# Altium project Proto_Lolek.PrjPcb
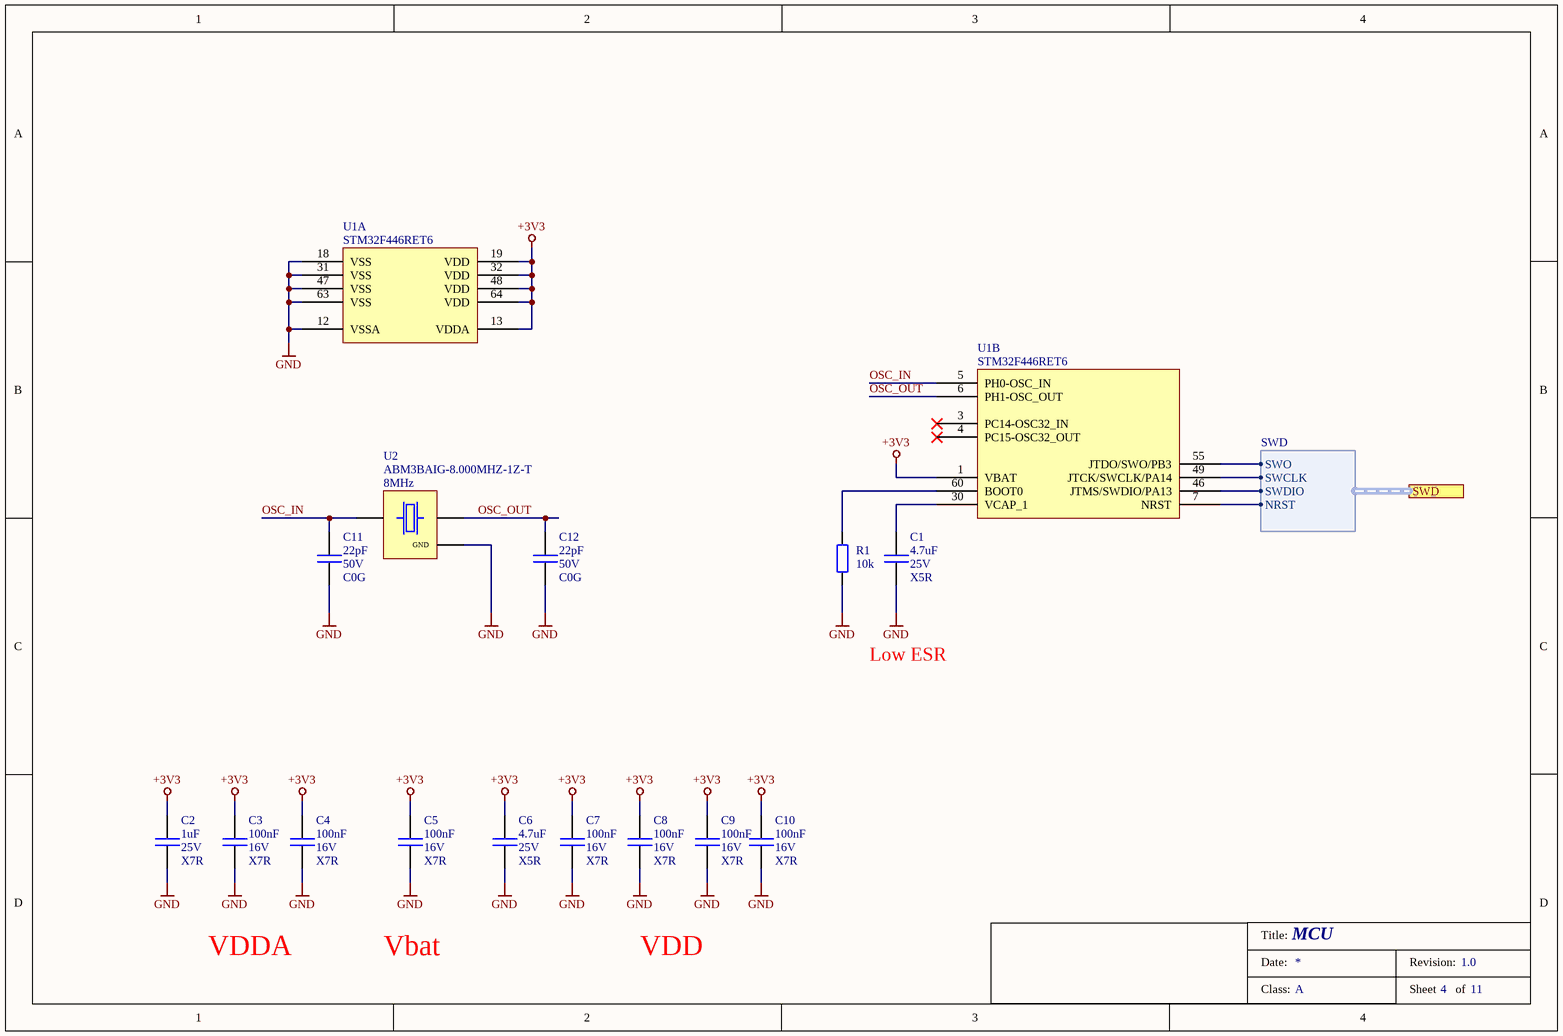
[diagram p0: MCU_Init.SchDoc]
7 sheets, 52 parts. Net scope: hierarchical (ports join the sheet entries above them; power ports are global).
Board file: Proto_Lolek.PcbDoc
Sheets:
  MCU_Init.SchDoc
  MCU_Supply.SchDoc
  Block_Diagram.SchDoc
    U_Current_Measurement = Current_Measurement.SchDoc
    U_Temp_NTC = Temp_NTC.SchDoc
    U_Connectors = Connectors.SchDoc
    U_Fan_Control = Fan_Control.SchDoc

## Sheet MCU_Init.SchDoc: MCU
size A4; Revision: 1.0; SheetNumber: 4; SheetTotal: 11; Class: A

### Parts
C1  value 4.7uF  Voltage: 25V  Dielectric: X5R  [C_0603]  (hidden comment: C)
C2  value 1uF  Voltage: 25V  Dielectric: X7R  [C_0603]  (hidden comment: C)
C3  value 100nF  Voltage: 16V  Dielectric: X7R  [C_0402]  (hidden comment: C)
C4  value 100nF  Voltage: 16V  Dielectric: X7R  [C_0402]  (hidden comment: C)
C5  value 100nF  Voltage: 16V  Dielectric: X7R  [C_0402]  (hidden comment: C)
C6  value 4.7uF  Voltage: 25V  Dielectric: X5R  [C_0603]  (hidden comment: C)
C7  value 100nF  Voltage: 16V  Dielectric: X7R  [C_0402]  (hidden comment: C)
C8  value 100nF  Voltage: 16V  Dielectric: X7R  [C_0402]  (hidden comment: C)
C9  value 100nF  Voltage: 16V  Dielectric: X7R  [C_0402]  (hidden comment: C)
C10  value 100nF  Voltage: 16V  Dielectric: X7R  [C_0402]  (hidden comment: C)
C11  value 22pF  Voltage: 50V  Dielectric: C0G  [C_0603]  (hidden comment: C)
C12  value 22pF  Voltage: 50V  Dielectric: C0G  [C_0603]  (hidden comment: C)
R1  value 10k  [R_0402]  (hidden comment: R)
U1  value STM32F446RET6  [LQFP64]  (hidden comment: MCU_STM32F446RET6)  (parts A,B of 3)
U2  value ABM3BAIG-8.000MHZ-1Z-T  Frequency: 8MHz  [CLK_ABM3BAIG_8_1Z_T]  (hidden comment: CLK_Crystal_4)

### Ports
SWD (harness SWD)

### Harnesses
SWD: SWO, SWCLK, SWDIO, NRST

### Nets
+3V3: C2.1 C3.1 C4.1 C5.1 C6.1 C7.1 C8.1 C9.1 C10.1 U1.1(VBAT) U1.13(VDDA) U1.19(VDD) U1.32(VDD) U1.48(VDD) U1.64(VDD)
GND: C1.2 C2.2 C3.2 C4.2 C5.2 C6.2 C7.2 C8.2 C9.2 C10.2 C11.2 C12.2 R1.1 U1.12(VSSA) U1.18(VSS) U1.31(VSS) U1.47(VSS) U1.63(VSS) U2.2(GND)
OSC_IN: C11.1 U1.5(PH0-OSC_IN) U2.1
OSC_OUT: C12.1 U1.6(PH1-OSC_OUT) U2.3
NetC1_1: C1.1 U1.30(VCAP_1)
NetR1_2: R1.2 U1.60(BOOT0)
NetU1_7: U1.7(NRST) ; port SWD.NRST
NetU1_46: U1.46(JTMS/SWDIO/PA13) ; port SWD.SWDIO
NetU1_49: U1.49(JTCK/SWCLK/PA14) ; port SWD.SWCLK
NetU1_55: U1.55(JTDO/SWO/PB3) ; port SWD.SWO

Not connected (* = marked no-connect by the designer): U1 3(PC14-OSC32_IN)* 4(PC15-OSC32_OUT)*

### Notes on the sheet
- Low ESR
- VDDA
- Vbat
- VDD
- Title:
- Date:
- Revision:
- Class:
- Sheet
- of

### Library data of the parts
C1 C6 = C_4.7uF_25V_0603: Capacitor; Manufacturer: TDK; Manufacturer Part Number: C1608X5R1E475K080AC; Tmax: 85; Tmin: -55; Grade: 3; Fail Rate: A; Tolerance: 10%; Part Number: C_4.7uF_25V_0603; HelpURL: https://product.tdk.com/system/files/dam/doc/product/capacitor/ceramic/mlcc/catalog/mlcc_commercial_general_en.pdf; Supplier 1: Mouser; Supplier Part Number 1: 810-C1608X5R1E475K; Status: Active
C2 = C_1uF_25V_0603: Capacitor; Manufacturer: Murata; Manufacturer Part Number: C0603T222K5RAC7867 / GCJ188R71E105KA01D; Tmax: 125; Tmin: -55; Grade: 2; Fail Rate: A; Tolerance: 10%; Part Number: C_1uF_25V_0603; HelpURL: https://www.murata.com/en-eu/api/pdfdownloadapi?cate=luCeramicCapacitorsSMD&partno=GCJ188R71E105KA01%23; Supplier 1: Mouser; Supplier Part Number 1: 81-GCJ188R71E105KA1D; Status: Active
C3-C5 C7-C10 = C_100nF_16V_0402: Capacitor; Manufacturer: Kemet; Manufacturer Part Number: C0402T104K4RAC7867; Tmax: 125; Tmin: -55; Grade: 2; Fail Rate: A; Tolerance: 10%; Part Number: C_100nF_16V_0402; HelpURL: https://api.kemet.com/component-edge/download/specsheet/C0402T104K4RACTU.pdf; Supplier 2: Mouser; Supplier Part Number 2: 80-C0402T104K4RACTU; Supplier 1: Digi-Key; Supplier Part Number 1: 399-17387-1-ND; Status: Active
C11 C12 = C_22pF_50V_0603: Capacitor; Manufacturer: Kemet; Manufacturer Part Number: C0603T220J5GAC7867; Tmax: 125; Tmin: -55; Grade: 2; Fail Rate: A; Tolerance: 5%; Part Number: C_22pF_50V_0603; HelpURL: https://content.kemet.com/datasheets/KEM_C1026_C0G_COTS_SMD.pdf; Supplier 1: Digi-Key; Supplier Part Number 1: 399-20427-1-ND; Status: Active
R1 = R_10k_50V_0402: Manufacturer: Vishay; Manufacturer Part Number: MCS0402PD1002DE500; Voltage: 50V; RMS Power: 0.2W; TCR: 25ppm; Tmax: 175; Tmin: -55; Grade: 2; Part Number: R_10k_50V_0402; HelpURL: https://www.vishay.com/docs/28916/mcxhp.pdf; Supplier 2: Mouser; Supplier Part Number 2: 594-MCS0402PD1002DP5; Supplier 1: Digi-Key; Supplier Part Number 1: 749-1515-1-ND; Status: Active
U1 = STM32F446RET6: ARM Microcontroller, Cortex-M4 core; Manufacturer: St; Tmax: 85; Tmin: -40; Grade: 3; Part Number: STM32F446RET6; HelpURL: https://www.st.com/content/ccc/resource/technical/document/datasheet/65/cb/75/50/53/d6/48/24/DM00141306.pdf/files/DM00141306.pdf/jcr:content/translations/en.DM00141306.pdf; Manufacturer Part Number: STM32F446RET6; Supplier 1: Mouser; Supplier Part Number 1: 511-STM32F446RET6; Status: Active
U2 = ABM3BAIG-8.000MHZ-1Z-T: Crystal; Manufacturer: ABRACON; Frequency Stability: ±50 ppm; Tmax: 125; Tmin: -40; Grade: 2; Part Number: ABM3BAIG-8.000MHZ-1Z-T; HelpURL: https://abracon.com/AIGcrystals/ABM3BAIG.pdf; Manufacturer Part Number: ABM3BAIG-8.000MHZ-1Z-T; Supplier 1: Mouser; Supplier Part Number 1: 815-M3BAIG-8-1ZT; Status: Active

## Sheet MCU_Supply.SchDoc: MCU Supply
size A4; Revision: 1.0; SheetNumber: 6; SheetTotal: 11; Class: B
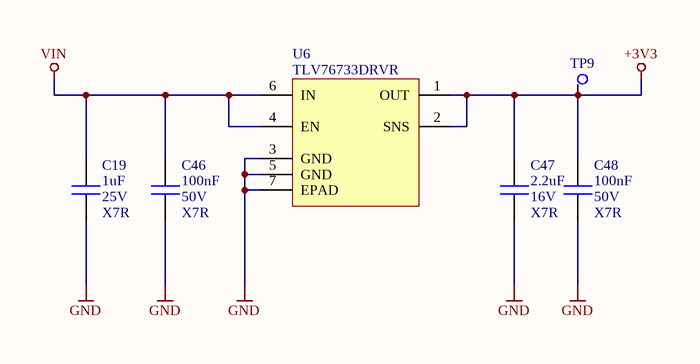
[diagram p1: MCU_Supply.SchDoc]

### Parts
C19  value 1uF  Voltage: 25V  Dielectric: X7R  [C_0603]  (hidden comment: C)
C46  value 100nF  Voltage: 50V  Dielectric: X7R  [C_0603]  (hidden comment: C)
C47  value 2.2uF  Voltage: 16V  Dielectric: X7R  [C_0805]  (hidden comment: C)
C48  value 100nF  Voltage: 50V  Dielectric: X7R  [C_0603]  (hidden comment: C)
TP9  TP_TestPoint  [TP_01]  (value not drawn)
U6  =Value: TLV76733DRVR  [WSON_6]  (hidden comment: IC_TLV76733DRVR)

### Nets
+3V3: C47.1 C48.1 TP9.1 U6.1(OUT) U6.2(SNS)
GND: C19.2 C46.2 C47.2 C48.2 U6.3(GND) U6.5(GND) U6.7(EPAD)
VIN: C19.1 C46.1 U6.4(EN) U6.6(IN)

### Notes on the sheet
- Title:
- Date:
- Revision:
- Class:
- Sheet
- of

### Library data of the parts
C19 = C_1uF_25V_0603: as C2 on sheet MCU_Init; Part Number: C_1uF_25V_0603; HelpURL: https://www.murata.com/en-eu/api/pdfdownloadapi?cate=luCeramicCapacitorsSMD&partno=GCJ188R71E105KA01%23; Supplier 1: Mouser; Supplier Part Number 1: 81-GCJ188R71E105KA1D; Status: Active
C46 C48 = C_100nF_50V_0603: Capacitor; Manufacturer: Kemet; Manufacturer Part Number: C0603T104K5RCL7136; Tmax: 125; Tmin: -55; Grade: 2; Fail Rate: A; Tolerance: 10%; Part Number: C_100nF_50V_0603; HelpURL: https://content.kemet.com/datasheets/KEM_C1027_X7R_COTS_SMD.pdf; Supplier 1: Digi-Key; Supplier Part Number 1: 399-6305-1-ND; Status: Active
C47 = C_2.2uF_16V_0805: Capacitor; Manufacturer: Kemet; Manufacturer Part Number: C0805T225K4RAL7800; Tmax: 125; Tmin: -55; Grade: 2; Fail Rate: A; Tolerance: 10%; Part Number: C_2.2uF_16V_0805; HelpURL: https://content.kemet.com/datasheets/KEM_C1027_X7R_COTS_SMD.pdf; Supplier 1: Digi-Key; Supplier Part Number 1: 399-17975-6-ND; Status: Active
TP9 = TestPoint1: Manufacturer: Progresja Space; Value: TP; Grade: 3; Part Number: TestPoint1; Status: Active
U6 = TLV76733DRVR: 3.3V LDO Voltage Regulator; Manufacturer: TI; Tmax: 125; Tmin: -40; Grade: 2; Part Number: TLV76733DRVR; Value: TLV76733DRVR; HelpURL: https://www.ti.com/lit/ds/symlink/tlv767.pdf?ts=1677533353578&ref_url=https%253A%252F%252Fwww.ti.com%252Fproduct%252FTLV767%252Fpart-details%252FTLV76733DRVR; Manufacturer Part Number: TLV76733DRVR; Supplier 2: Mouser; Supplier Part Number 2: 595-TLV76733DRVR; Status: Active

## Sheet Block_Diagram.SchDoc: Block Diagram
size A4; Revision: 1.0; SheetNumber: 1; SheetTotal: 11; Class: B
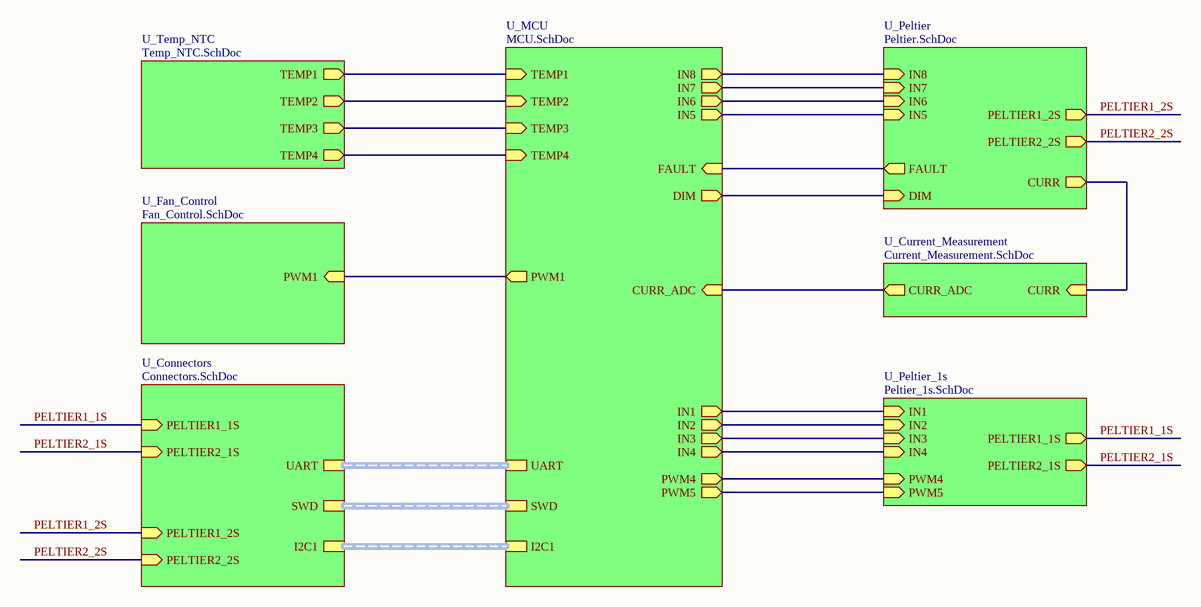
[diagram p2: Block_Diagram.SchDoc]

### Sub-sheets
U_Connectors = Connectors.SchDoc: SWD (harness SWD), UART (harness UART), PELTIER1_2S (in), PELTIER2_1S (in), PELTIER1_1S (in), PELTIER2_2S (in), I2C1 (harness I2C1)
U_Current_Measurement = Current_Measurement.SchDoc: CURR_ADC (out), CURR (in)
U_Fan_Control = Fan_Control.SchDoc: PWM1 (in)
U_MCU = MCU.SchDoc (file not in this document): FAULT (in), CURR_ADC (in), SWD (harness SWD), TEMP1 (in), TEMP2 (in), TEMP3 (in), TEMP4 (in), DIM (out), UART (harness UART), PWM1 (out), PWM4 (out), IN2 (out), IN4 (out), IN3 (out), PWM5 (out), IN1 (out), IN6 (out), IN5 (out), IN8 (out), IN7 (out), I2C1
U_Peltier = Peltier.SchDoc (file not in this document): DIM (in), FAULT (out), PELTIER1_2S (out), PELTIER2_2S (out), IN6 (in), IN5 (in), CURR (out), IN8 (in), IN7 (in)
U_Peltier_1s = Peltier_1s.SchDoc (file not in this document): PELTIER1_1S (out), PELTIER2_1S (out), PWM4 (in), PWM5 (in), IN1 (in), IN2 (in), IN3 (in), IN4 (in)
U_Temp_NTC = Temp_NTC.SchDoc: TEMP1 (out), TEMP3 (out), TEMP4 (out), TEMP2 (out)

### Nets
PELTIER1_1S: sheet U_Connectors/PELTIER1_1S, sheet U_Peltier_1s/PELTIER1_1S
PELTIER1_2S: sheet U_Peltier/PELTIER1_2S, sheet U_Connectors/PELTIER1_2S
PELTIER2_1S: sheet U_Connectors/PELTIER2_1S, sheet U_Peltier_1s/PELTIER2_1S
PELTIER2_2S: sheet U_Peltier/PELTIER2_2S, sheet U_Connectors/PELTIER2_2S
NetR2_2: sheet U_Temp_NTC/TEMP1, sheet U_MCU/TEMP1
NetR3_2: sheet U_Temp_NTC/TEMP2, sheet U_MCU/TEMP2
NetR6_2: sheet U_Temp_NTC/TEMP3, sheet U_MCU/TEMP3
NetR7_2: sheet U_Temp_NTC/TEMP4, sheet U_MCU/TEMP4
NetR19_1: sheet U_Current_Measurement/CURR, sheet U_Peltier/CURR
NetR28_1: sheet U_MCU/PWM1, sheet U_Fan_Control/PWM1
NetTP1_1: sheet U_Current_Measurement/CURR_ADC, sheet U_MCU/CURR_ADC
(unnamed): sheet U_Peltier/DIM, sheet U_MCU/DIM
(unnamed): sheet U_Peltier/FAULT, sheet U_MCU/FAULT
(unnamed): sheet U_Peltier/IN6, sheet U_MCU/IN6
(unnamed): sheet U_Peltier/IN5, sheet U_MCU/IN5
(unnamed): sheet U_Peltier/IN8, sheet U_MCU/IN8
(unnamed): sheet U_Peltier/IN7, sheet U_MCU/IN7
(unnamed): sheet U_MCU/PWM4, sheet U_Peltier_1s/PWM4
(unnamed): sheet U_MCU/IN2, sheet U_Peltier_1s/IN2
(unnamed): sheet U_MCU/IN4, sheet U_Peltier_1s/IN4
(unnamed): sheet U_MCU/IN3, sheet U_Peltier_1s/IN3
(unnamed): sheet U_MCU/PWM5, sheet U_Peltier_1s/PWM5
(unnamed): sheet U_MCU/IN1, sheet U_Peltier_1s/IN1

### Buses and harness runs
harness sheet U_Connectors/I2C1 = sheet U_MCU/I2C1
harness sheet U_Connectors/SWD = sheet U_MCU/SWD
harness sheet U_Connectors/UART = sheet U_MCU/UART

### Notes on the sheet
- Title:
- Date:
- Revision:
- Class:
- Sheet
- of

## Sheet Current_Measurement.SchDoc: Current Measurement
size A4; Revision: 1.0; SheetNumber: 9; SheetTotal: 11; Class: B
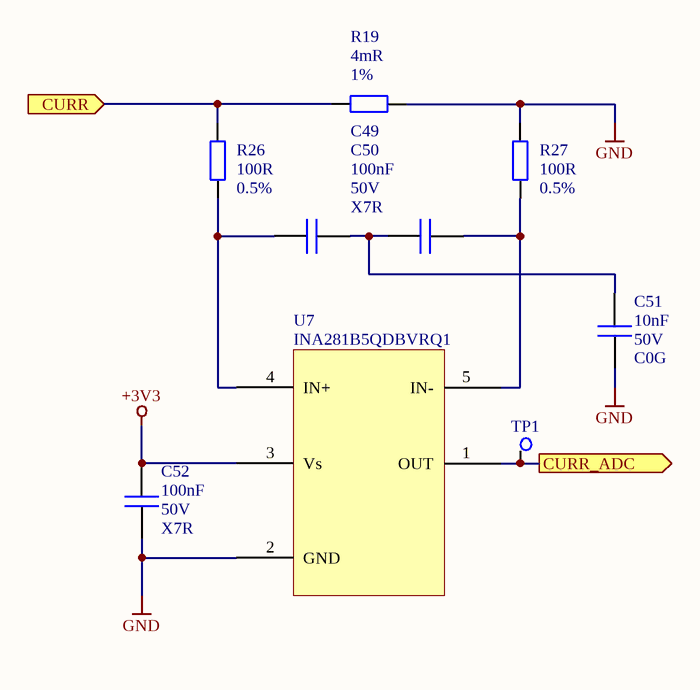
[diagram p3: Current_Measurement.SchDoc]

### Parts
C49  value 100nF  Voltage: 50V  Dielectric: X7R  [C_0603]  (hidden comment: C)
C50  C  [C_0603]  (value not drawn)
C51  value 10nF  Voltage: 50V  Dielectric: C0G  [C_0603]  (hidden comment: C)
C52  value 100nF  Voltage: 50V  Dielectric: X7R  [C_0603]  (hidden comment: C)
R19  value 4mR  Tolerance: 1%  [R_1206]  (hidden comment: R)
R26  value 100R  Tolerance: 0.5%  [R_0402]  (hidden comment: R)
R27  value 100R  Tolerance: 0.5%  [R_0402]  (hidden comment: R)
TP1  TP_TestPoint  [TP_01]  (value not drawn)
U7  value INA281B5QDBVRQ1  [SOT_23_5]  (hidden comment: IC_INA281B_Q1)

### Ports
CURR (in), CURR_ADC (out)

### Nets
+3V3: C52.1 U7.3(Vs)
GND: C51.2 C52.2 R19.2 R27.1 U7.2(GND)
NetC49_1: C49.1 R26.2 U7.4(IN+)
NetC49_2: C49.2 C50.1 C51.1
NetC50_2: C50.2 R27.2 U7.5(IN-)
NetR19_1: R19.1 R26.1 ; port CURR
NetTP1_1: TP1.1 U7.1(OUT) ; port CURR_ADC

### Notes on the sheet
- Title:
- Date:
- Revision:
- Class:
- Sheet
- of

### Library data of the parts
C49 C52 = C_100nF_50V_0603: as C46 on sheet MCU_Supply; Part Number: C_100nF_50V_0603; HelpURL: https://content.kemet.com/datasheets/KEM_C1027_X7R_COTS_SMD.pdf; Supplier 1: Digi-Key; Supplier Part Number 1: 399-6305-1-ND; Status: Active
C50 = C_100nF_50V_0603: Capacitor; Manufacturer: Kemet; Manufacturer Part Number: C0603T104K5RCL7136; Voltage: 50V; Dielectric: X7R; Value: 100nF; Tmax: 125; Tmin: -55; Grade: 2; Fail Rate: A; Tolerance: 10%; Part Number: C_100nF_50V_0603; HelpURL: https://content.kemet.com/datasheets/KEM_C1027_X7R_COTS_SMD.pdf; Supplier 1: Digi-Key; Supplier Part Number 1: 399-6305-1-ND; Status: Active
C51 = C_10nF_50V_0603: Capacitor; Manufacturer: Kemet; Manufacturer Part Number: C0603T103J5RAC7867; Tmax: 125; Tmin: -55; Grade: 2; Fail Rate: A; Tolerance: 5%; Part Number: C_10nF_50V_0603; HelpURL: https://content.kemet.com/datasheets/KEM_C1027_X7R_COTS_SMD.pdf; Supplier 1: Digi-Key; Supplier Part Number 1: 399-20387-1-ND; Status: Active
R19 = R_4mR_NA_1206: Manufacturer: YAGEO; Manufacturer Part Number: PA1206FRE470R004Z; Voltage: NA; RMS Power: 1W; TCR: 50ppm; Tmax: 170; Tmin: -55; Grade: 2; Part Number: R_4mR_NA_1206; HelpURL: https://www.yageo.com/upload/media/product/products/datasheet/rchip/PYu-PA0100_2512_51_RoHS_2.pdf; Supplier 1: Mouser; Supplier Part Number 1: 603-PA1206FRE470R04Z; Status: Active
R26 R27 = R_100R_50V_0402: Manufacturer: Vishay; Manufacturer Part Number: MCS0402PD1000DE500; Voltage: 50V; RMS Power: 0.2W; TCR: 25ppm; Tmax: 175; Tmin: -55; Grade: 2; Part Number: R_100R_50V_0402; HelpURL: https://www.vishay.com/docs/28916/mcxhp.pdf; Supplier 2: Mouser; Supplier Part Number 2: 594-MCS0402PD1000DP5; Supplier 1: Digi-Key; Supplier Part Number 1: 749-1509-1-ND; Status: Active
TP1 = TestPoint1: as TP9 on sheet MCU_Supply; Part Number: TestPoint1; Status: Active
U7 = INA281B5QDBVRQ1: Current Sense Amplifiers Automotive AEC-Q100, -4-V to 110-V, 1.3-MHz; Manufacturer: TI; Tmax: 125; Tmin: -40; Grade: 2; Part Number: INA281B5QDBVRQ1; HelpURL: https://www.ti.com/lit/ds/symlink/ina281-q1.pdf?ts=1661510274550&ref_url=https%253A%252F%252Fwww.google.com%252F; Manufacturer Part Number: INA281B5QDBVRQ1; Supplier 1: Mouser; Supplier Part Number 1: 595-INA281B5QDBVRQ1; Status: Active

## Sheet Temp_NTC.SchDoc: Temp NTC
size A4; Revision: 1.0; SheetNumber: 7; SheetTotal: 11; Class: B
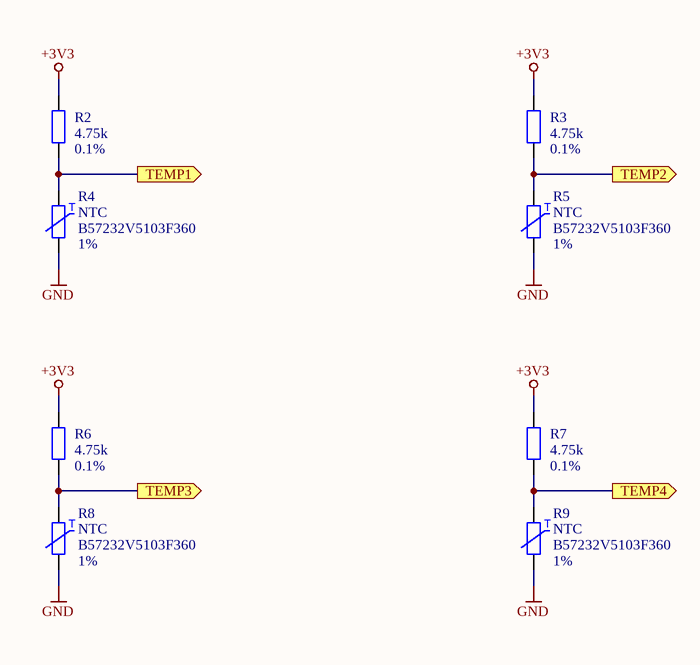
[diagram p4: Temp_NTC.SchDoc]

### Parts
R2  value 4.75k  Tolerance: 0.1%  [R_0402]  (hidden comment: R)
R3  value 4.75k  Tolerance: 0.1%  [R_0402]  (hidden comment: R)
R4  value B57232V5103F360  Tolerance: 1%  [R_0402]  (hidden comment: R_B572xxV5)
R5  value B57232V5103F360  Tolerance: 1%  [R_0402]  (hidden comment: R_B572xxV5)
R6  value 4.75k  Tolerance: 0.1%  [R_0402]  (hidden comment: R)
R7  value 4.75k  Tolerance: 0.1%  [R_0402]  (hidden comment: R)
R8  value B57232V5103F360  Tolerance: 1%  [R_0402]  (hidden comment: R_B572xxV5)
R9  value B57232V5103F360  Tolerance: 1%  [R_0402]  (hidden comment: R_B572xxV5)

### Ports
TEMP1 (out), TEMP2 (out), TEMP3 (out), TEMP4 (out)

### Nets
+3V3: R2.1 R3.1 R6.1 R7.1
GND: R4.2 R5.2 R8.2 R9.2
NetR2_2: R2.2 R4.1 ; port TEMP1
NetR3_2: R3.2 R5.1 ; port TEMP2
NetR6_2: R6.2 R8.1 ; port TEMP3
NetR7_2: R7.2 R9.1 ; port TEMP4

### Notes on the sheet
- Title:
- Date:
- Revision:
- Class:
- Sheet
- of
- (in symbol B57232V5103F360) T

### Library data of the parts
R2 R3 R6 R7 = R_4.75k_50V_0402: Manufacturer: Vishay; Manufacturer Part Number: MCS0402MD4751BE100; Voltage: 50V; RMS Power: 0.1W; TCR: 25ppm; Tmax: 155; Tmin: -55; Grade: 2; Part Number: R_4.75k_50V_0402; HelpURL: https://www.vishay.com/docs/28785/mcat_pre.pdf; Supplier 2: Mouser; Supplier Part Number 2: 594-MCS0402MD4751BE1; Supplier 1: Digi-Key; Supplier Part Number 1: MCS0402-4.75K-MBCT-ND
R4 R5 R8 R9 = B57232V5103F360: NTC; Manufacturer: TDK; Resistance: 10k; Tmax: 150; Tmin: -40; Grade: 2; Desc: NTC; Part Number: B57232V5103F360; HelpURL: https://product.tdk.com/info/en/documents/data_sheet/50/db/ntc/NTC_SMD_Automotive_series_0402.pdf; Manufacturer Part Number: B57232V5103F360; Supplier 1: Mouser; Supplier Part Number 1: 871-B57232V5103F360; Status: Active

## Sheet Connectors.SchDoc: Connectors
size A4; Revision: 1.0; SheetNumber: 2; SheetTotal: 11; Class: B
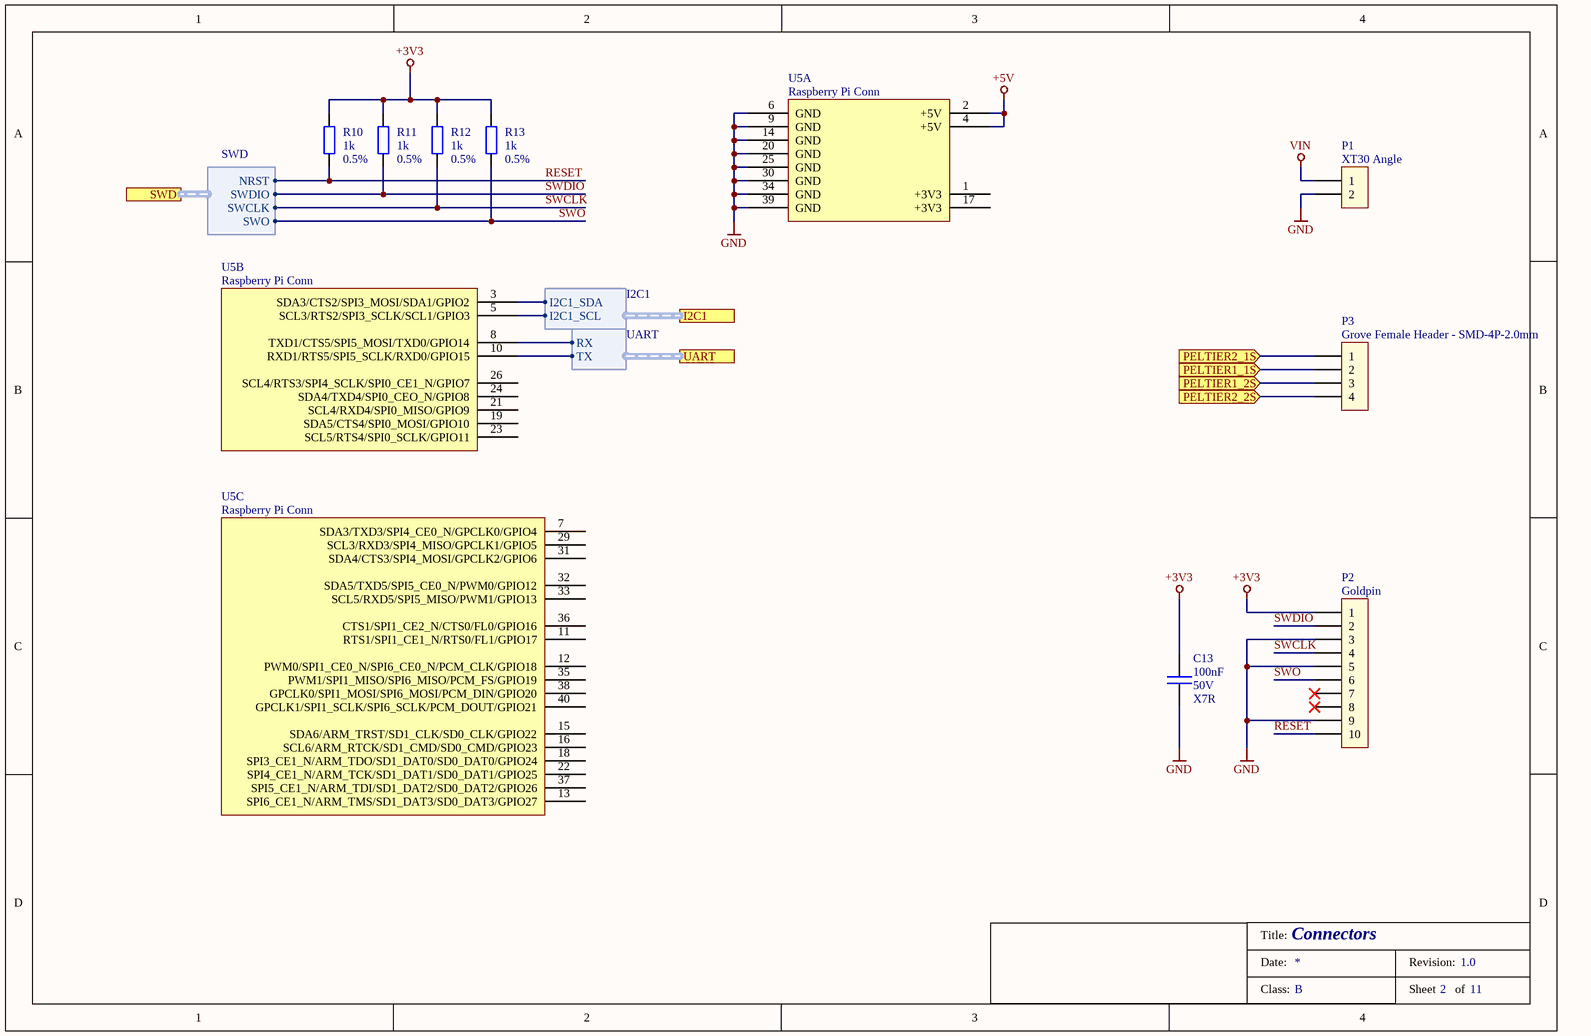
[diagram p5: Connectors.SchDoc]

### Parts
C13  value 100nF  Voltage: 50V  Dielectric: X7R  [C_0603]  (hidden comment: C)
P1  P_Header_2  [XT30_ANGL]  (value not drawn)
P2  P_Header_10  [CONN_M50_3610542]  (value not drawn)
P3  P_Header_4  [CONN_114020164]  (value not drawn)
R10  value 1k  Tolerance: 0.5%  [R_0402]  (hidden comment: R)
R11  value 1k  Tolerance: 0.5%  [R_0402]  (hidden comment: R)
R12  value 1k  Tolerance: 0.5%  [R_0402]  (hidden comment: R)
R13  value 1k  Tolerance: 0.5%  [R_0402]  (hidden comment: R)
U5  value Raspberry Pi Conn  [CONN_Raspberry_Pi]  (hidden comment: M_Raspberry_Pi_4B)  (parts A,B,C of 3)

### Ports
I2C1 (harness I2C1), PELTIER1_1S (in), PELTIER1_2S (in), PELTIER2_1S (in), PELTIER2_2S (in), SWD (harness SWD), UART (harness UART)

### Harnesses
SWD: NRST, SWDIO, SWCLK, SWO
UART: TX, RX
I2C1: I2C1_SCL, I2C1_SDA

### Nets
+3V3: C13.1 P2.1 R10.1 R11.1 R12.1 R13.1
+5V: U5.2(+5V) U5.4(+5V)
GND: C13.2 P1.2 P2.3 P2.5 P2.9 U5.6(GND) U5.9(GND) U5.14(GND) U5.20(GND) U5.25(GND) U5.30(GND) U5.34(GND) U5.39(GND)
VIN: P1.1
PELTIER1_1S: P3.2 ; port PELTIER1_1S
PELTIER1_2S: P3.3 ; port PELTIER1_2S
PELTIER2_1S: P3.1 ; port PELTIER2_1S
PELTIER2_2S: P3.4 ; port PELTIER2_2S
RESET: P2.10 R10.2 ; port SWD.NRST
SWCLK: P2.4 R12.2 ; port SWD.SWCLK
SWDIO: P2.2 R11.2 ; port SWD.SWDIO
SWO: P2.6 R13.2 ; port SWD.SWO
NetU5_3: U5.3(SDA3/CTS2/SPI3_MOSI/SDA1/GPIO2) ; port I2C1.I2C1_SDA
NetU5_5: U5.5(SCL3/RTS2/SPI3_SCLK/SCL1/GPIO3) ; port I2C1.I2C1_SCL
NetU5_8: U5.8(TXD1/CTS5/SPI5_MOSI/TXD0/GPIO14) ; port UART.RX
NetU5_10: U5.10(RXD1/RTS5/SPI5_SCLK/RXD0/GPIO15) ; port UART.TX

Not connected (* = marked no-connect by the designer): P2 7* 8*; U5 1(+3V3) 7(SDA3/TXD3/SPI4_CE0_N/GPCLK0/GPIO4) 11(RTS1/SPI1_CE1_N/RTS0/FL1/GPIO17) 12(PWM0/SPI1_CE0_N/SPI6_CE0_N/PCM_CLK/GPIO18) 13(SPI6_CE1_N/ARM_TMS/SD1_DAT3/SD0_DAT3/GPIO27) 15(SDA6/ARM_TRST/SD1_CLK/SD0_CLK/GPIO22) 16(SCL6/ARM_RTCK/SD1_CMD/SD0_CMD/GPIO23) 17(+3V3) 18(SPI3_CE1_N/ARM_TDO/SD1_DAT0/SD0_DAT0/GPIO24) 19(SDA5/CTS4/SPI0_MOSI/GPIO10) 21(SCL4/RXD4/SPI0_MISO/GPIO9) 22(SPI4_CE1_N/ARM_TCK/SD1_DAT1/SD0_DAT1/GPIO25) 23(SCL5/RTS4/SPI0_SCLK/GPIO11) 24(SDA4/TXD4/SPI0_CEO_N/GPIO8) 26(SCL4/RTS3/SPI4_SCLK/SPI0_CE1_N/GPIO7) 29(SCL3/RXD3/SPI4_MISO/GPCLK1/GPIO5) 31(SDA4/CTS3/SPI4_MOSI/GPCLK2/GPIO6) 32(SDA5/TXD5/SPI5_CE0_N/PWM0/GPIO12) 33(SCL5/RXD5/SPI5_MISO/PWM1/GPIO13) 35(PWM1/SPI1_MISO/SPI6_MISO/PCM_FS/GPIO19) 36(CTS1/SPI1_CE2_N/CTS0/FL0/GPIO16) 37(SPI5_CE1_N/ARM_TDI/SD1_DAT2/SD0_DAT2/GPIO26) 38(GPCLK0/SPI1_MOSI/SPI6_MOSI/PCM_DIN/GPIO20) 40(GPCLK1/SPI1_SCLK/SPI6_SCLK/PCM_DOUT/GPIO21)

### Notes on the sheet
- Title:
- Date:
- Revision:
- Class:
- Sheet
- of

### Library data of the parts
C13 = C_100nF_50V_0603: as C46 on sheet MCU_Supply; Part Number: C_100nF_50V_0603; HelpURL: https://content.kemet.com/datasheets/KEM_C1027_X7R_COTS_SMD.pdf; Supplier 1: Digi-Key; Supplier Part Number 1: 399-6305-1-ND; Status: Active
P1 = XT30-ANGLE: XT30 Angle; Manufacturer: DFRobot; Manufacturer Part Number: XT30PW-M; Grade: 3; Value: XT30 Angle; Desc: XT30 Angle; Part Number: XT30-ANGLE; HelpURL: https://www.tme.eu/Document/6eb2005a51a52592b3f19e8a450c54c8/XT30PW-M.pdf; Supplier 1: TME; Supplier Part Number 1: XT30PW-M; Status: Active
P2 = M50-3610542: Goldpin; Manufacturer: Harwin; Tmax: 105; Tmin: -40; Grade: 3; Value: M50-3610542; Desc: Goldpin; Part Number: M50-3610542; HelpURL: https://cdn.harwin.com/pdfs/M50-361.pdf; Manufacturer Part Number: M50-3610542; Supplier 1: Mouser; Supplier Part Number 1: 855-M50-3610542; Status: Active
P3 = 114020164: Grove Female Header - SMD-4P-2.0mm; Manufacturer: SEEED; Grade: 3; Value: 114020164; Desc: Grove Female Header - SMD-4P-2.0mm; Part Number: 114020164; HelpURL: https://files.seeedstudio.com/products/114020164/res/Grove%20Female%20Header%20-%20SMD-4P-2.0mm-90D%20Datasheet.pdf; Manufacturer Part Number: 114020164; Supplier 1: Mouser; Supplier Part Number 1: 713-114020164; Status: Active
R10-R13 = R_1k_50V_0402: Manufacturer: Vishay; Manufacturer Part Number: MCS0402PD1001DE500; Voltage: 50V; RMS Power: 0.2W; TCR: 25ppm; Tmax: 175; Tmin: -55; Grade: 2; Part Number: R_1k_50V_0402; HelpURL: https://www.vishay.com/docs/28916/mcxhp.pdf; Supplier 2: Mouser; Supplier Part Number 2: 594-MCS0402PD1001DP5; Supplier 1: Digi-Key; Supplier Part Number 1: 749-1511-1-ND; Status: Active
U5 = CONN_Raspberry_Pi: Raspberry Pi female connector; Manufacturer: TE Connectivity; Manufacturer Part Number: 1-534998-0; Tmax: 105; Tmin: -65; Grade: 3; Part Number: CONN_Raspberry_Pi; HelpURL: https://www.te.com/commerce/DocumentDelivery/DDEController?Action=showdoc&DocId=Specification+Or+Standard%7F114-25018%7FE%7Fpdf%7FEnglish%7FENG_SS_114-25018_E.pdf%7F1-534998-0; Supplier 1: Mouser; Supplier Part Number 1: 571-1534998; Status: Active

## Sheet Fan_Control.SchDoc: Fan Control
size A4; Revision: 1.0; SheetNumber: 10; SheetTotal: 11; Class: B
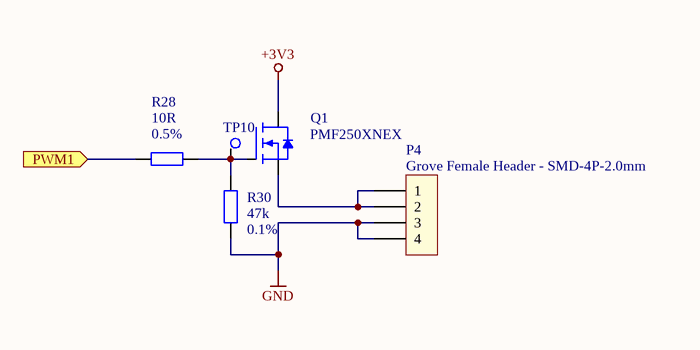
[diagram p6: Fan_Control.SchDoc]

### Parts
P4  P_Header_4  [CONN_114020164]  (value not drawn)
Q1  value PMF250XNEX  [SOT323]  (hidden comment: Q_NMOSFET)
R28  value 10R  Tolerance: 0.5%  [R_0603]  (hidden comment: R)
R30  value 47k  Tolerance: 0.1%  [R_0402]  (hidden comment: R)
TP10  TP_TestPoint  [TP_01]  (value not drawn)

### Ports
PWM1 (in)

### Nets
+3V3: Q1.3(D)
GND: P4.3 P4.4 R30.2
NetP4_1: P4.1 P4.2 Q1.2(S)
NetQ1_1: Q1.1(G) R28.2 R30.1 TP10.1
NetR28_1: R28.1 ; port PWM1

### Notes on the sheet
- Title:
- Date:
- Revision:
- Class:
- Sheet
- of

### Library data of the parts
P4 = 114020164: as P3 on sheet Connectors; Value: 114020164; Desc: Grove Female Header - SMD-4P-2.0mm; Part Number: 114020164; HelpURL: https://files.seeedstudio.com/products/114020164/res/Grove%20Female%20Header%20-%20SMD-4P-2.0mm-90D%20Datasheet.pdf; Manufacturer Part Number: 114020164; Supplier 1: Mouser; Supplier Part Number 1: 713-114020164; Status: Active
Q1 = PMF250XNEX: 30V 1A Single N-Channel; Manufacturer: NEXPERIA; Max Power Dissipation: 0.342w; Tmax: 150; Tmin: -55; Grade: 2; Part Number: PMF250XNEX; HelpURL: https://assets.nexperia.com/documents/data-sheet/PMF250XNE.pdf; Manufacturer Part Number: PMF250XNEX; Supplier 1: Mouser; Supplier Part Number 1: 771-PMF250XNEX; Status: Active
R28 = R_10R_75V_0603: Manufacturer: Vishay; Manufacturer Part Number: MCT0603PD1009DP500; Voltage: 75V; RMS Power: 0.25W; TCR: 25ppm; Tmax: 175; Tmin: -55; Grade: 2; Part Number: R_10R_75V_0603; HelpURL: https://www.vishay.com/docs/28916/mcxhp.pdf; Supplier 2: Mouser; Supplier Part Number 2: 594-MCT0603PD1009DP5; Supplier 1: Digi-Key; Supplier Part Number 1: 749-1520-1-ND; Status: Active
R30 = R_47k_50V_0402: Manufacturer: Vishay; Manufacturer Part Number: MCS0402MD4702BE100; Voltage: 50V; RMS Power: 0.1W; TCR: 25ppm; Tmax: 155; Tmin: -55; Grade: 2; Part Number: R_47k_50V_0402; HelpURL: https://www.vishay.com/docs/28785/mcat_pre.pdf; Supplier 2: Mouser; Supplier Part Number 2: 594-MCS0402MD4702BE1; Supplier 1: Digi-Key; Supplier Part Number 1: MCS0402-47.0K-MBCT-ND; Status: Active
TP10 = TestPoint1: as TP9 on sheet MCU_Supply; Part Number: TestPoint1; Status: Active

## Nets that join several sheets
+3V3: MCU_Init (15 pins), MCU_Supply (5 pins), Current_Measurement (C52.1 U7.3), Temp_NTC (R2.1 R3.1 R6.1 R7.1), Connectors (6 pins), Fan_Control (Q1.3)
GND: MCU_Init (19 pins), MCU_Supply (7 pins), Current_Measurement (5 pins), Temp_NTC (R4.2 R5.2 R8.2 R9.2), Connectors (13 pins), Fan_Control (P4.3 P4.4 R30.2)
VIN: MCU_Supply (C19.1 C46.1 U6.4 U6.6), Connectors (P1.1)